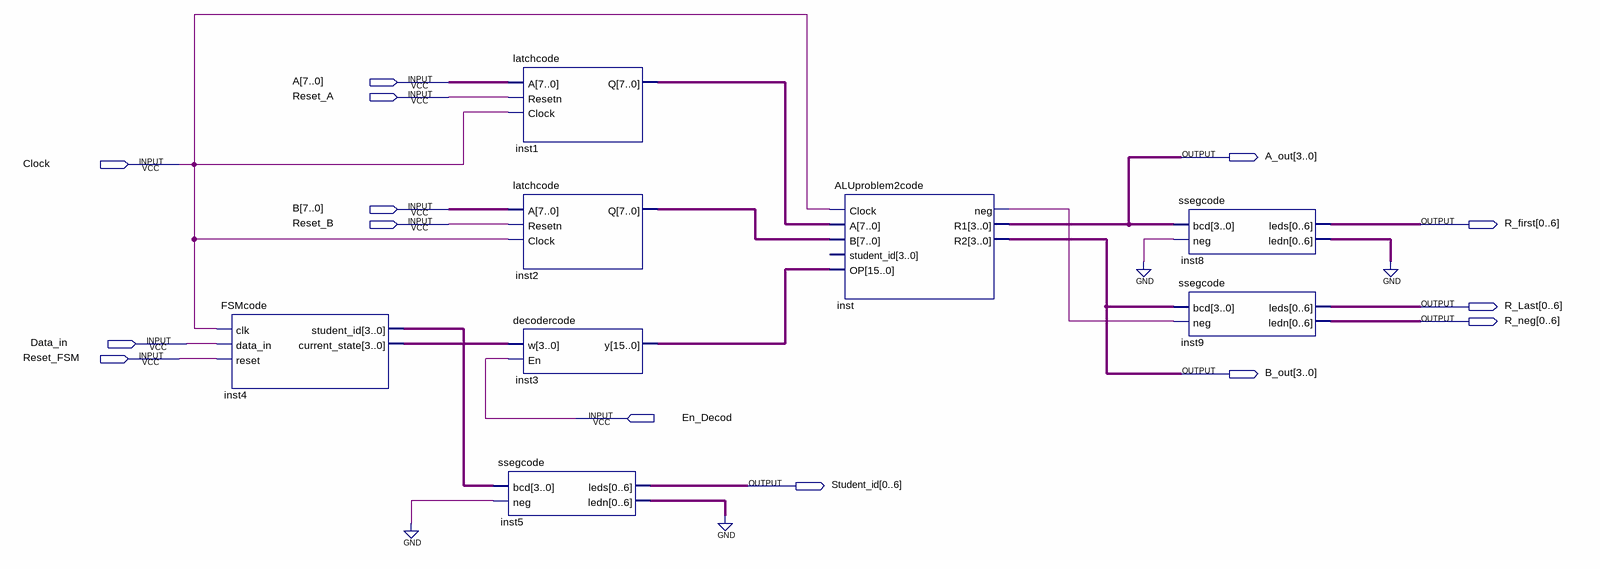
[diagram p0: schematic sheet]
// Quartus schematic ALUproblem2schem.bdf as structural Verilog: 8 symbols, 14 pins
module ALUproblem2schem (
  input  [7:0] A,
  input  Reset_A,
  input  Clock,
  input  [7:0] B,
  input  Reset_B,
  input  Data_in,
  input  Reset_FSM,
  input  En_Decod,
  output [3:0] A_out,
  output [0:6] R_first,
  output [0:6] R_Last,
  output [0:6] R_neg,
  output [3:0] B_out,
  output [0:6] Student_id
);

  wire inst_neg;
  wire [3:0] inst4_current_state, inst4_student_id;
  wire [6:0] inst5_ledn, inst8_ledn;
  wire [7:0] inst1_q, inst2_q;
  wire [15:0] inst3_y;

  FSMcode inst4 (
    .clk(Clock), .data_in(Data_in), .reset(Reset_FSM), .student_id(inst4_student_id),
    .current_state(inst4_current_state));
  latchcode inst1 (.A(A), .Resetn(Reset_A), .Clock(Clock), .Q(inst1_q));
  latchcode inst2 (.A(B), .Resetn(Reset_B), .Clock(Clock), .Q(inst2_q));
  decodercode inst3 (.w(inst4_current_state), .En(En_Decod), .y(inst3_y));
  ssegcode inst5 (.bcd(inst4_student_id), .neg(1'b0), .leds(Student_id), .ledn(inst5_ledn));
  ALUproblem2code inst (
    .Clock(Clock), .A(inst1_q), .B(inst2_q), .OP(inst3_y), .neg(inst_neg), .R1(A_out), .R2(B_out));  // open: student_id
  ssegcode inst8 (.bcd(A_out), .neg(1'b0), .leds(R_first), .ledn(inst8_ledn));
  ssegcode inst9 (.bcd(B_out), .neg(inst_neg), .leds(R_Last), .ledn(R_neg));
  // also tied to GND on the sheet: {inst5_ledn[0], inst5_ledn[1], inst5_ledn[2], inst5_ledn[3], inst5_ledn[4], inst5_ledn[5], inst5_ledn[6], inst8_ledn[0], inst8_ledn[1], inst8_ledn[2], inst8_ledn[3], inst8_ledn[4], inst8_ledn[5], inst8_ledn[6]}
endmodule
